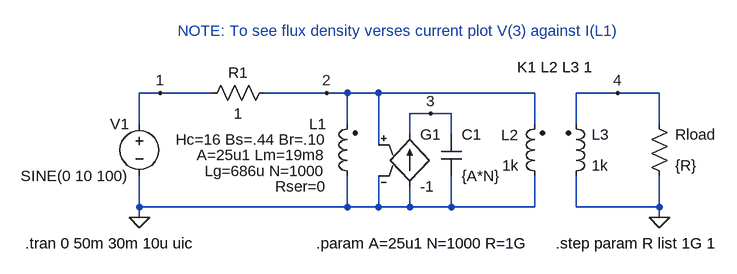
[diagram p0: schematic MikeXformer.asc]
MikeXformer.asc, the LTspice schematic file:
Version 4
SHEET 1 1608 680
WIRE 560 192 560 240
WIRE 240 64 272 64
WIRE 240 256 240 240
WIRE 240 112 240 64
WIRE 432 64 528 64
WIRE 560 64 528 64
WIRE 560 64 560 112
WIRE 608 240 560 240
WIRE 912 240 1040 240
WIRE 1040 64 1040 112
WIRE 1040 192 1040 240
WIRE 912 64 976 64
WIRE 1040 240 1040 256
WIRE 848 64 848 112
WIRE 848 192 848 240
WIRE 912 240 912 192
WIRE 912 112 912 64
WIRE 560 240 240 240
WIRE 240 240 240 192
WIRE 272 64 352 64
WIRE 608 192 608 240
WIRE 608 64 608 144
WIRE 656 128 656 96
WIRE 656 96 688 96
WIRE 720 96 720 128
WIRE 720 192 720 240
WIRE 720 240 656 240
WIRE 656 240 656 208
WIRE 656 240 608 240
WIRE 720 240 848 240
WIRE 848 64 608 64
WIRE 560 64 608 64
WIRE 688 96 720 96
WIRE 976 64 1040 64
FLAG 240 256 0
FLAG 1040 256 0
FLAG 272 64 1
FLAG 528 64 2
FLAG 688 96 3
FLAG 976 64 4
SYMBOL ind2 576 208 R180
WINDOW 123 48 48 Left 0
WINDOW 39 48 24 Left 0
WINDOW 40 48 0 Left 0
WINDOW 0 48 96 Left 0
WINDOW 3 48 72 Left 0
SYMATTR Value2 A=25u1 Lm=19m8
SYMATTR SpiceLine Lg=686u N=1000
SYMATTR SpiceLine2 Rser=0
SYMATTR InstName L1
SYMATTR Value Hc=16 Bs=.44 Br=.10
SYMATTR Type ind
SYMBOL voltage 240 96 M0
WINDOW 0 16 16 Left 0
WINDOW 3 16 96 Left 0
WINDOW 123 0 0 Left 0
WINDOW 39 0 0 Left 0
SYMATTR InstName V1
SYMATTR Value SINE(0 10 100)
SYMBOL res 336 80 R270
WINDOW 0 32 56 VTop 0
WINDOW 3 0 56 VBottom 0
SYMATTR InstName R1
SYMATTR Value 1
SYMBOL res 1024 96 R0
WINDOW 0 40 32 Left 0
WINDOW 3 40 80 Left 0
SYMATTR InstName Rload
SYMATTR Value {R}
SYMBOL ind2 864 208 R180
WINDOW 0 40 79 Left 0
WINDOW 3 40 32 Left 0
SYMATTR InstName L2
SYMATTR Value 1k
SYMATTR Type ind
SYMATTR SpiceLine Rser=1u
SYMBOL ind2 896 208 M180
WINDOW 0 40 80 Left 0
WINDOW 3 40 32 Left 0
SYMATTR InstName L3
SYMATTR Value 1k
SYMATTR Type ind
SYMATTR SpiceLine Rser=1u
SYMBOL g 656 112 R0
WINDOW 0 16 16 Left 0
WINDOW 3 16 96 Left 0
SYMATTR InstName G1
SYMATTR Value -1
SYMBOL cap 704 128 R0
WINDOW 0 32 0 Left 0
WINDOW 3 32 64 Left 0
SYMATTR InstName C1
SYMATTR Value {A*N}
TEXT 1128 296 Right 0 !.step param R list 1G 1
TEXT 880 24 Center 0 !K1 L2 L3 1
TEXT 64 296 Left 0 !.tran 0 50m 30m 10u uic
TEXT 512 296 Left 0 !.param A=25u1 N=1000 R=1G
TEXT 640 -16 Bottom 0 ;NOTE: To see flux density verses current plot V(3) against I(L1)

The netlist it stands for:
* MikeXformer.asc
L1 0 2 Hc=16 Bs=.44 Br=.10 A=25u1 Lm=19m8 Lg=686u N=1000 Rser=0
V1 1 0 SINE(0 10 100)
R1 1 2 1
Rload 4 0 {R}
L2 0 2 1k Rser=1u
L3 0 4 1k Rser=1u
G1 0 3 2 0 -1
C1 3 0 {A*N}
.step param R list 1G 1
K1 L2 L3 1
.tran 0 50m 30m 10u uic
.param A=25u1 N=1000 R=1G
* NOTE: To see flux density verses current plot V(3) against I(L1)
.backanno
.end